# EAGLE design MiniCob (EAGLE 6.1)

## Sheet 1 of 4
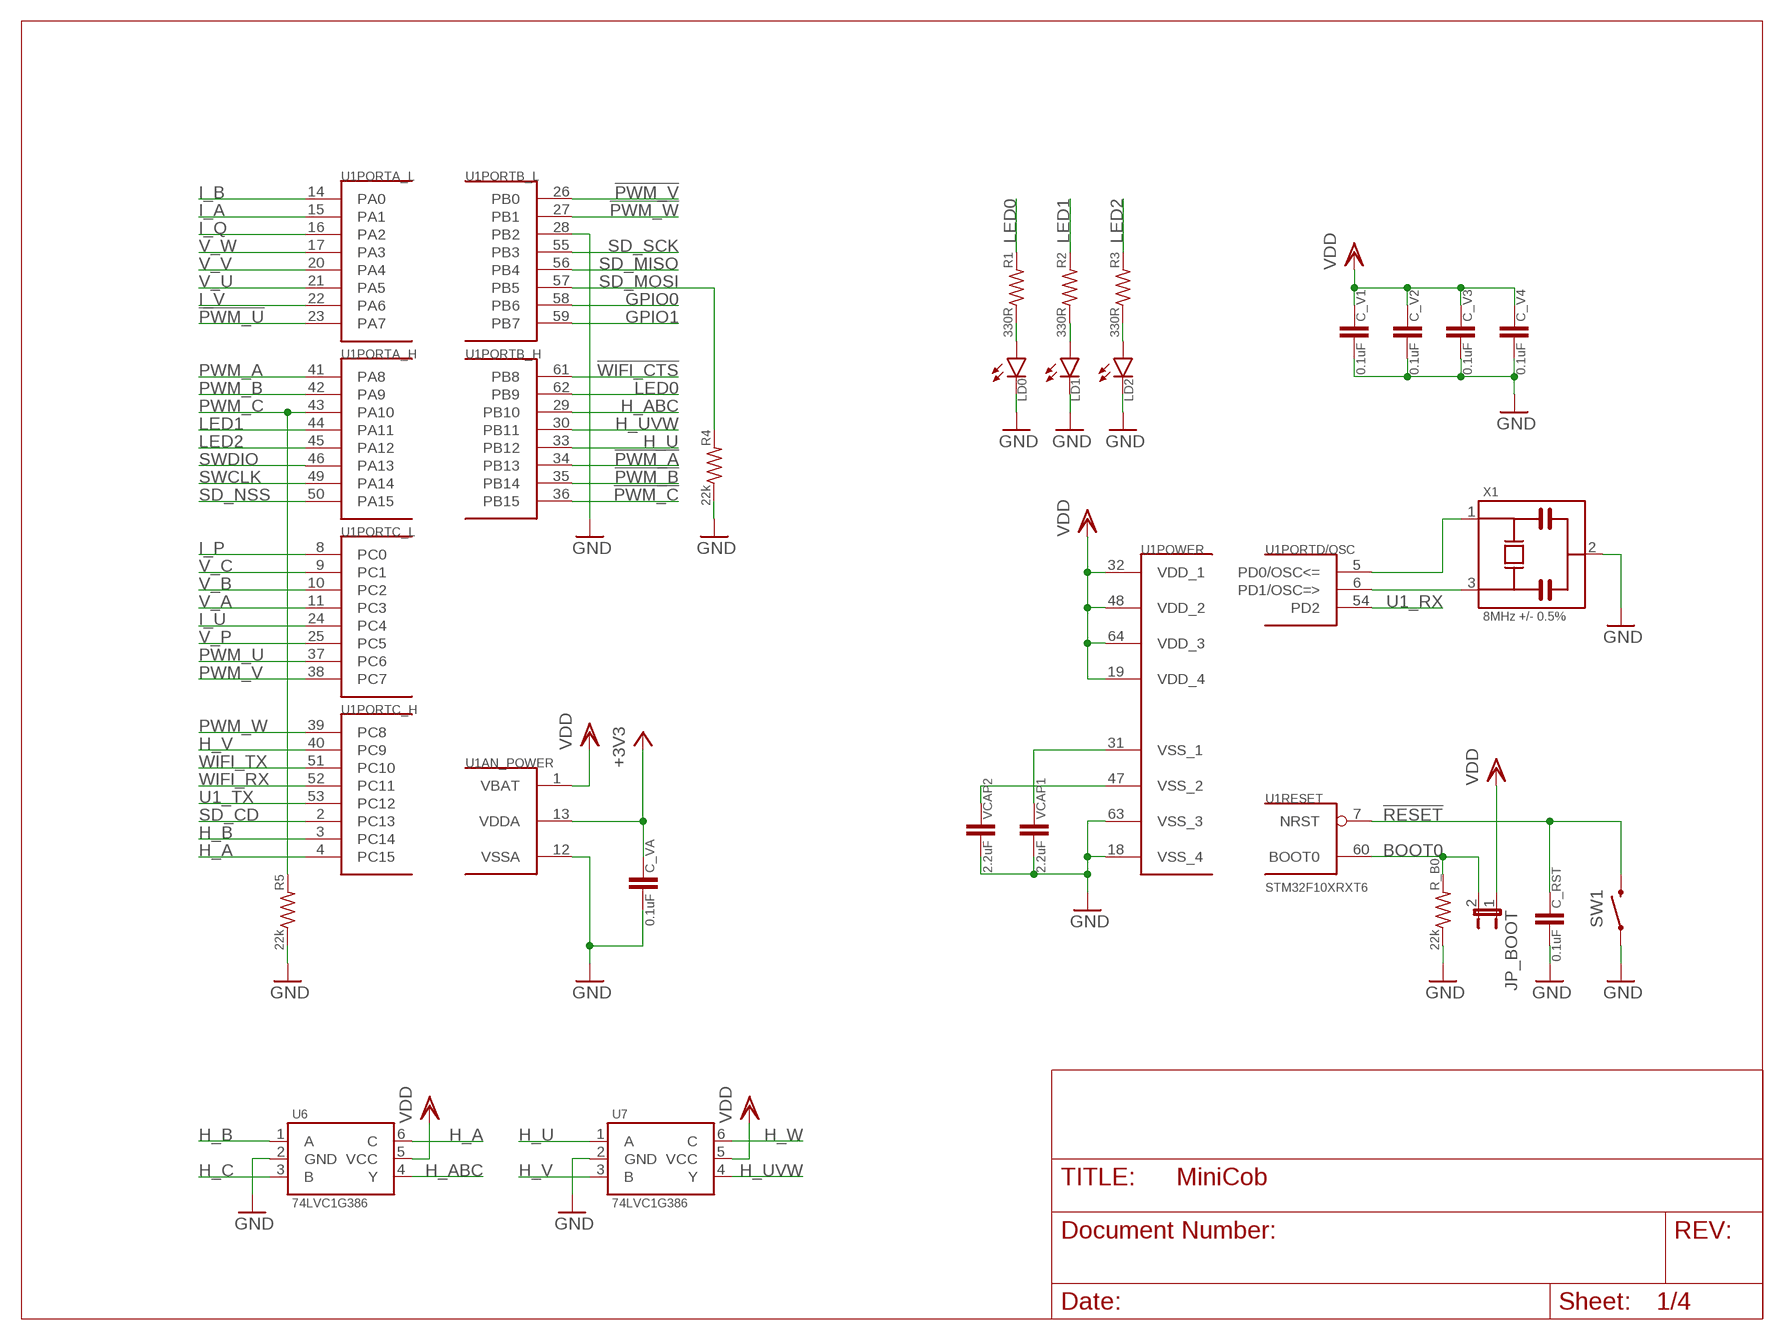
[diagram p0: schematic, sheet 1]

### Parts
C_RST  0.1uF  C0603  [0603]
C_V1  0.1uF  C0603  [0603]
C_V2  0.1uF  C0603  [0603]
C_V3  0.1uF  C0603  [0603]
C_V4  0.1uF  C0603  [0603]
C_VA  0.1uF  C0603  [0603]
JP_BOOT  JUMPER-2PTH  [1X02]
LD0  LED0805  [0805_POL]
LD1  LED0805  [0805_POL]
LD2  LED0805  [0805_POL]
R1  330R  R0603  [0603]
R2  330R  R0603  [0603]
R3  330R  R0603  [0603]
R4  22k  R0603  [0603]
R5  22k  R0603  [0603]
R_B0  22k  R0603  [0603]
SW1  SWITCH_SPST-NO  [B3U-1000P]
U1  STM32F10XRXT6  [TQFP64]
U6  74LVC1G386  [SC-70]
U7  74LVC1G386  [SC-70]
VCAP1  2.2uF  C0603  [0603]
VCAP2  2.2uF  C0603  [0603]
X1  8MHz +/- 0.5%  MURATA_CSTCE  [MURATA_CSTCE]

### Nets
!PWM_A: U1.34(PORTB_H:PB13) ; also sheet 2
!PWM_B: U1.35(PORTB_H:PB14) ; also sheet 2
!PWM_C: U1.36(PORTB_H:PB15) ; also sheet 2
!PWM_U: U1.23(PORTA_L:PA7) ; also sheet 2
!PWM_V: U1.26(PORTB_L:PB0) ; also sheet 2
!PWM_W: U1.27(PORTB_L:PB1) ; also sheet 2
!RESET: C_RST.1 SW1.2 U1.7(RESET:NRST) ; also sheet 2
!WIFI_CTS: U1.61(PORTB_H:PB8) ; also sheet 3
+3V3: C_VA.1 U1.13(AN_POWER:VDDA) ; also sheet 4
BOOT0: JP_BOOT.2 R_B0.2 U1.60(RESET:BOOT0)
GND: C_RST.2 C_V1.2 C_V2.2 C_V3.2 C_V4.2 C_VA.2 LD0.-(C) LD1.-(C) LD2.-(C) R4.1 R5.1 R_B0.1 SW1.1 U1.12(AN_POWER:VSSA) U1.18(POWER:VSS_4) U1.28(PORTB_L:PB2) U1.63(POWER:VSS_3) U6.2(GND) U7.2(GND) VCAP1.2 VCAP2.2 X1.2 ; also sheet 2,3,4
GPIO0: U1.58(PORTB_L:PB6) ; also sheet 2
GPIO1: U1.59(PORTB_L:PB7) ; also sheet 2
H_A: U1.4(PORTC_H:PC15) U6.6(C) ; also sheet 2
H_ABC: U1.29(PORTB_H:PB10) U6.4(Y)
H_B: U1.3(PORTC_H:PC14) U6.1(A) ; also sheet 2
H_C: U6.3(B) ; also sheet 2
H_U: U1.33(PORTB_H:PB12) U7.1(A) ; also sheet 2
H_UVW: U1.30(PORTB_H:PB11) U7.4(Y)
H_V: U1.40(PORTC_H:PC9) U7.3(B) ; also sheet 2
H_W: U7.6(C) ; also sheet 2
I_A: U1.15(PORTA_L:PA1) ; also sheet 2
I_B: U1.14(PORTA_L:PA0) ; also sheet 2
I_P: U1.8(PORTC_L:PC0) ; also sheet 2
I_Q: U1.16(PORTA_L:PA2) ; also sheet 2
I_U: U1.24(PORTC_L:PC4) ; also sheet 2
I_V: U1.22(PORTA_L:PA6) ; also sheet 2
LED0: R1.2 U1.62(PORTB_H:PB9)
LED1: R2.2 U1.44(PORTA_H:PA11)
LED2: R3.2 U1.45(PORTA_H:PA12)
N$1: U1.6(PORTD/OSC:PD1/OSC=>) X1.3
N$2: U1.5(PORTD/OSC:PD0/OSC<=) X1.1
N$3: U1.47(POWER:VSS_2) VCAP2.1
N$4: U1.31(POWER:VSS_1) VCAP1.1
N$5: LD0.+(A) R1.1
N$6: LD1.+(A) R2.1
N$7: LD2.+(A) R3.1
PWM_A: U1.41(PORTA_H:PA8) ; also sheet 2
PWM_B: U1.42(PORTA_H:PA9) ; also sheet 2
PWM_C: R5.2 U1.43(PORTA_H:PA10) ; also sheet 2
PWM_U: U1.37(PORTC_L:PC6) ; also sheet 2
PWM_V: U1.38(PORTC_L:PC7) ; also sheet 2
PWM_W: U1.39(PORTC_H:PC8) ; also sheet 2
SD_CD: U1.2(PORTC_H:PC13) ; also sheet 3
SD_MISO: U1.56(PORTB_L:PB4) ; also sheet 3
SD_MOSI: R4.2 U1.57(PORTB_L:PB5) ; also sheet 3
SD_NSS: U1.50(PORTA_H:PA15) ; also sheet 3
SD_SCK: U1.55(PORTB_L:PB3) ; also sheet 3
SWCLK: U1.49(PORTA_H:PA14) ; also sheet 2
SWDIO: U1.46(PORTA_H:PA13) ; also sheet 2
U1_RX: U1.54(PORTD/OSC:PD2) ; also sheet 2
U1_TX: U1.53(PORTC_H:PC12) ; also sheet 2
V_A: U1.11(PORTC_L:PC3) ; also sheet 2
V_B: U1.10(PORTC_L:PC2) ; also sheet 2
V_C: U1.9(PORTC_L:PC1) ; also sheet 2
V_P: U1.25(PORTC_L:PC5) ; also sheet 2
V_U: U1.21(PORTA_L:PA5) ; also sheet 2
V_V: U1.20(PORTA_L:PA4) ; also sheet 2
V_W: U1.17(PORTA_L:PA3) ; also sheet 2
VDD: C_V1.1 C_V2.1 C_V3.1 C_V4.1 JP_BOOT.1 U1.1(AN_POWER:VBAT) U1.19(POWER:VDD_4) U1.32(POWER:VDD_1) U1.48(POWER:VDD_2) U1.64(POWER:VDD_3) U6.5(VCC) U7.5(VCC) ; also sheet 2,3,4
WIFI_RX: U1.52(PORTC_H:PC11) ; also sheet 3
WIFI_TX: U1.51(PORTC_H:PC10) ; also sheet 3

## Sheet 2 of 4
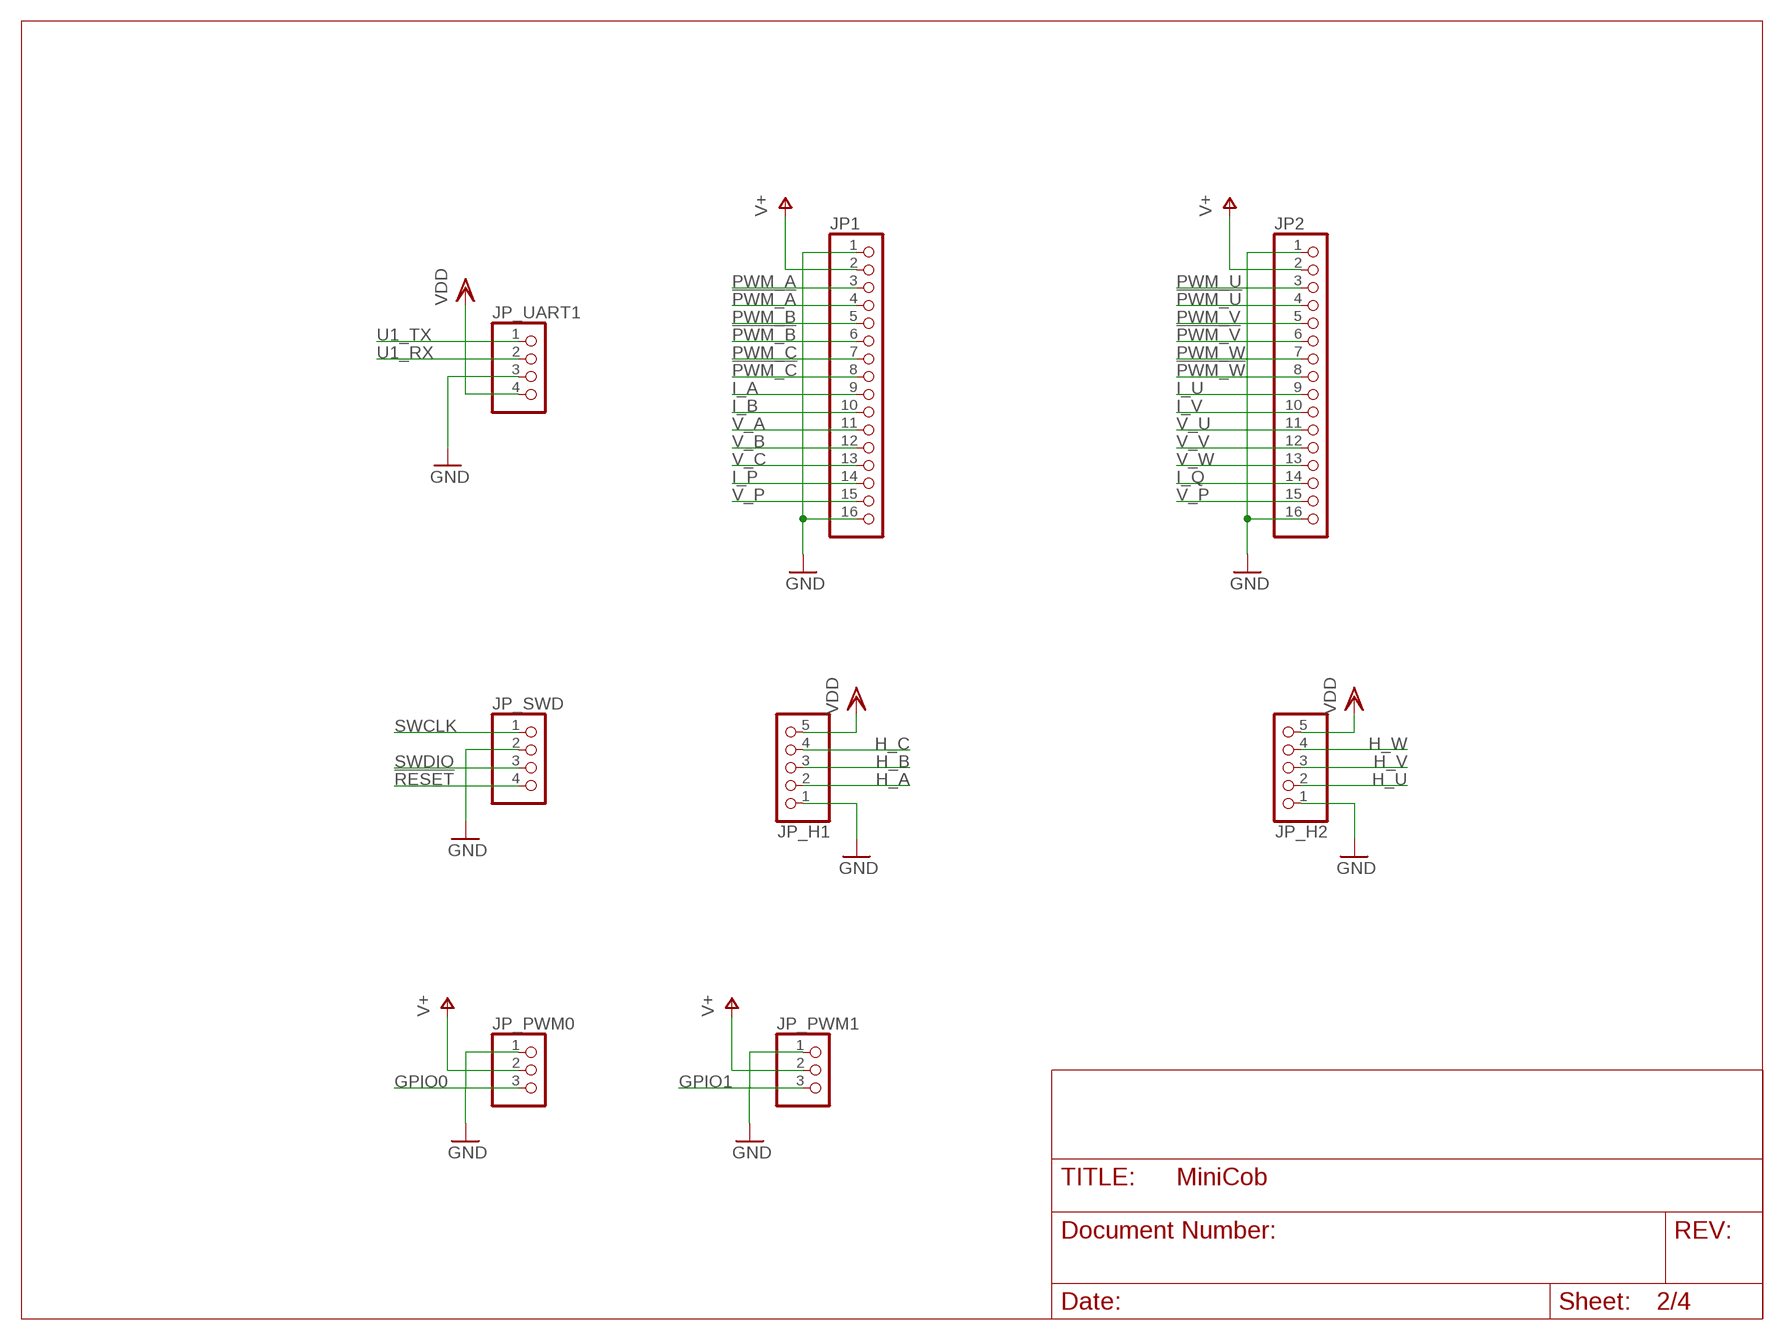
[diagram p1: schematic, sheet 2]

### Parts
JP1  PINHD-1X16_2.54-S  [1X16-S]
JP2  PINHD-1X16_2.54-S  [1X16-S]
JP_H1  PINHD-1X05_2.54-S  [1X05-S]
JP_H2  PINHD-1X05_2.54-S  [1X05-S]
JP_PWM0  PINHD-1X03_2.54-S  [1X03-S]
JP_PWM1  PINHD-1X03_2.54-S  [1X03-S]
JP_SWD  PINHD-1X04_2.54-S  [1X04-S]
JP_UART1  PINHD-1X04_2.54-S  [1X04-S]

### Nets
!PWM_A: JP1.4 ; also sheet 1
!PWM_B: JP1.6 ; also sheet 1
!PWM_C: JP1.8 ; also sheet 1
!PWM_U: JP2.4 ; also sheet 1
!PWM_V: JP2.6 ; also sheet 1
!PWM_W: JP2.8 ; also sheet 1
!RESET: JP_SWD.4 ; also sheet 1
GND: JP1.1 JP1.16 JP2.1 JP2.16 JP_H1.1 JP_H2.1 JP_PWM0.1 JP_PWM1.1 JP_SWD.2 JP_UART1.3 ; also sheet 1,3,4
GPIO0: JP_PWM0.3 ; also sheet 1
GPIO1: JP_PWM1.3 ; also sheet 1
H_A: JP_H1.2 ; also sheet 1
H_B: JP_H1.3 ; also sheet 1
H_C: JP_H1.4 ; also sheet 1
H_U: JP_H2.2 ; also sheet 1
H_V: JP_H2.3 ; also sheet 1
H_W: JP_H2.4 ; also sheet 1
I_A: JP1.9 ; also sheet 1
I_B: JP1.10 ; also sheet 1
I_P: JP1.14 ; also sheet 1
I_Q: JP2.14 ; also sheet 1
I_U: JP2.9 ; also sheet 1
I_V: JP2.10 ; also sheet 1
PWM_A: JP1.3 ; also sheet 1
PWM_B: JP1.5 ; also sheet 1
PWM_C: JP1.7 ; also sheet 1
PWM_U: JP2.3 ; also sheet 1
PWM_V: JP2.5 ; also sheet 1
PWM_W: JP2.7 ; also sheet 1
SWCLK: JP_SWD.1 ; also sheet 1
SWDIO: JP_SWD.3 ; also sheet 1
U1_RX: JP_UART1.2 ; also sheet 1
U1_TX: JP_UART1.1 ; also sheet 1
V+: JP1.2 JP2.2 JP_PWM0.2 JP_PWM1.2 ; also sheet 4
V_A: JP1.11 ; also sheet 1
V_B: JP1.12 ; also sheet 1
V_C: JP1.13 ; also sheet 1
V_P: JP1.15 JP2.15 ; also sheet 1
V_U: JP2.11 ; also sheet 1
V_V: JP2.12 ; also sheet 1
V_W: JP2.13 ; also sheet 1
VDD: JP_H1.5 JP_H2.5 JP_UART1.4 ; also sheet 1,3,4

## Sheet 3 of 4
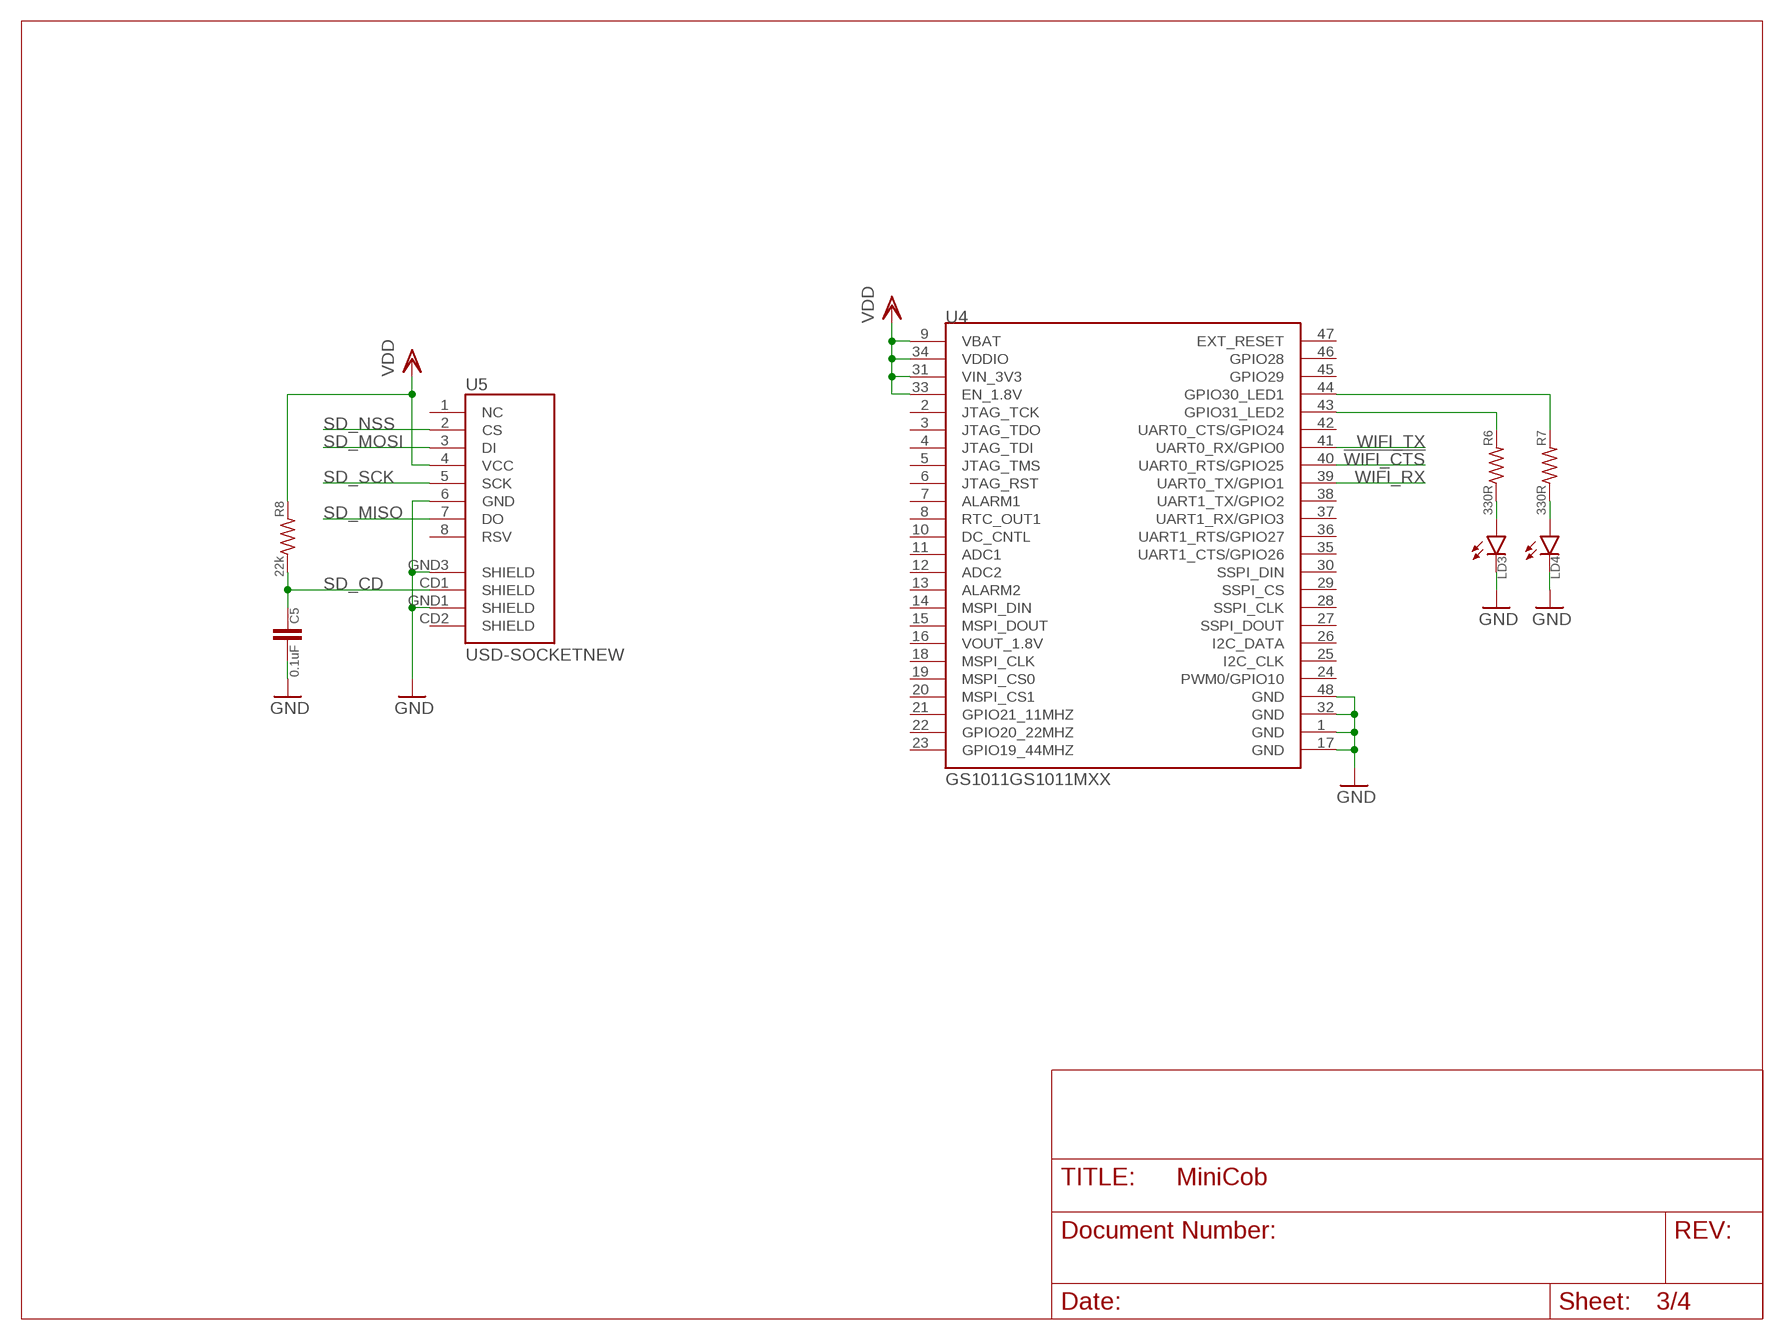
[diagram p2: schematic, sheet 3]

### Parts
C5  0.1uF  C0603  [0603]
LD3  LED0805  [0805_POL]
LD4  LED0805  [0805_POL]
R6  330R  R0603  [0603]
R7  330R  R0603  [0603]
R8  22k  R0603  [0603]
U4  GS1011GS1011MXX  [GS1011MXX]
U5  USD-SOCKETNEW  [MICRO-SD-SOCKET-PP]

### Nets
!WIFI_CTS: U4.40(UART0_RTS/GPIO25) ; also sheet 1
GND: C5.2 LD3.-(C) LD4.-(C) U4.1(GND) U4.17(GND) U4.32(GND) U4.48(GND) U5.6(GND) U5.GND1(SHIELD) U5.GND3(SHIELD) ; also sheet 1,2,4
N$8: R7.2 U4.44(GPIO30_LED1)
N$9: R6.2 U4.43(GPIO31_LED2)
N$10: LD3.+(A) R6.1
N$11: LD4.+(A) R7.1
SD_CD: C5.1 R8.1 U5.CD1(SHIELD) ; also sheet 1
SD_MISO: U5.7(DO) ; also sheet 1
SD_MOSI: U5.3(DI) ; also sheet 1
SD_NSS: U5.2(CS) ; also sheet 1
SD_SCK: U5.5(SCK) ; also sheet 1
VDD: R8.2 U4.9(VBAT) U4.31(VIN_3V3) U4.33(EN_1.8V) U4.34(VDDIO) U5.4(VCC) ; also sheet 1,2,4
WIFI_RX: U4.39(UART0_TX/GPIO1) ; also sheet 1
WIFI_TX: U4.41(UART0_RX/GPIO0) ; also sheet 1
Unconnected: U4.2(JTAG_TCK) U4.3(JTAG_TDO) U4.4(JTAG_TDI) U4.5(JTAG_TMS) U4.6(JTAG_RST) U4.7(ALARM1) U4.8(RTC_OUT1) U4.10(DC_CNTL) U4.11(ADC1) U4.12(ADC2) U4.13(ALARM2) U4.14(MSPI_DIN) U4.15(MSPI_DOUT) U4.16(VOUT_1.8V) U4.18(MSPI_CLK) U4.19(MSPI_CS0) U4.20(MSPI_CS1) U4.21(GPIO21_11MHZ) U4.22(GPIO20_22MHZ) U4.23(GPIO19_44MHZ) U4.24(PWM0/GPIO10) U4.25(I2C_CLK) U4.26(I2C_DATA) U4.27(SSPI_DOUT) U4.28(SSPI_CLK) U4.29(SSPI_CS) U4.30(SSPI_DIN) U4.35(UART1_CTS/GPIO26) U4.36(UART1_RTS/GPIO27) U4.37(UART1_RX/GPIO3) U4.38(UART1_TX/GPIO2) U4.42(UART0_CTS/GPIO24) U4.45(GPIO29) U4.46(GPIO28) U4.47(EXT_RESET) U5.1(NC) U5.8(RSV) U5.CD2(SHIELD)

## Sheet 4 of 4
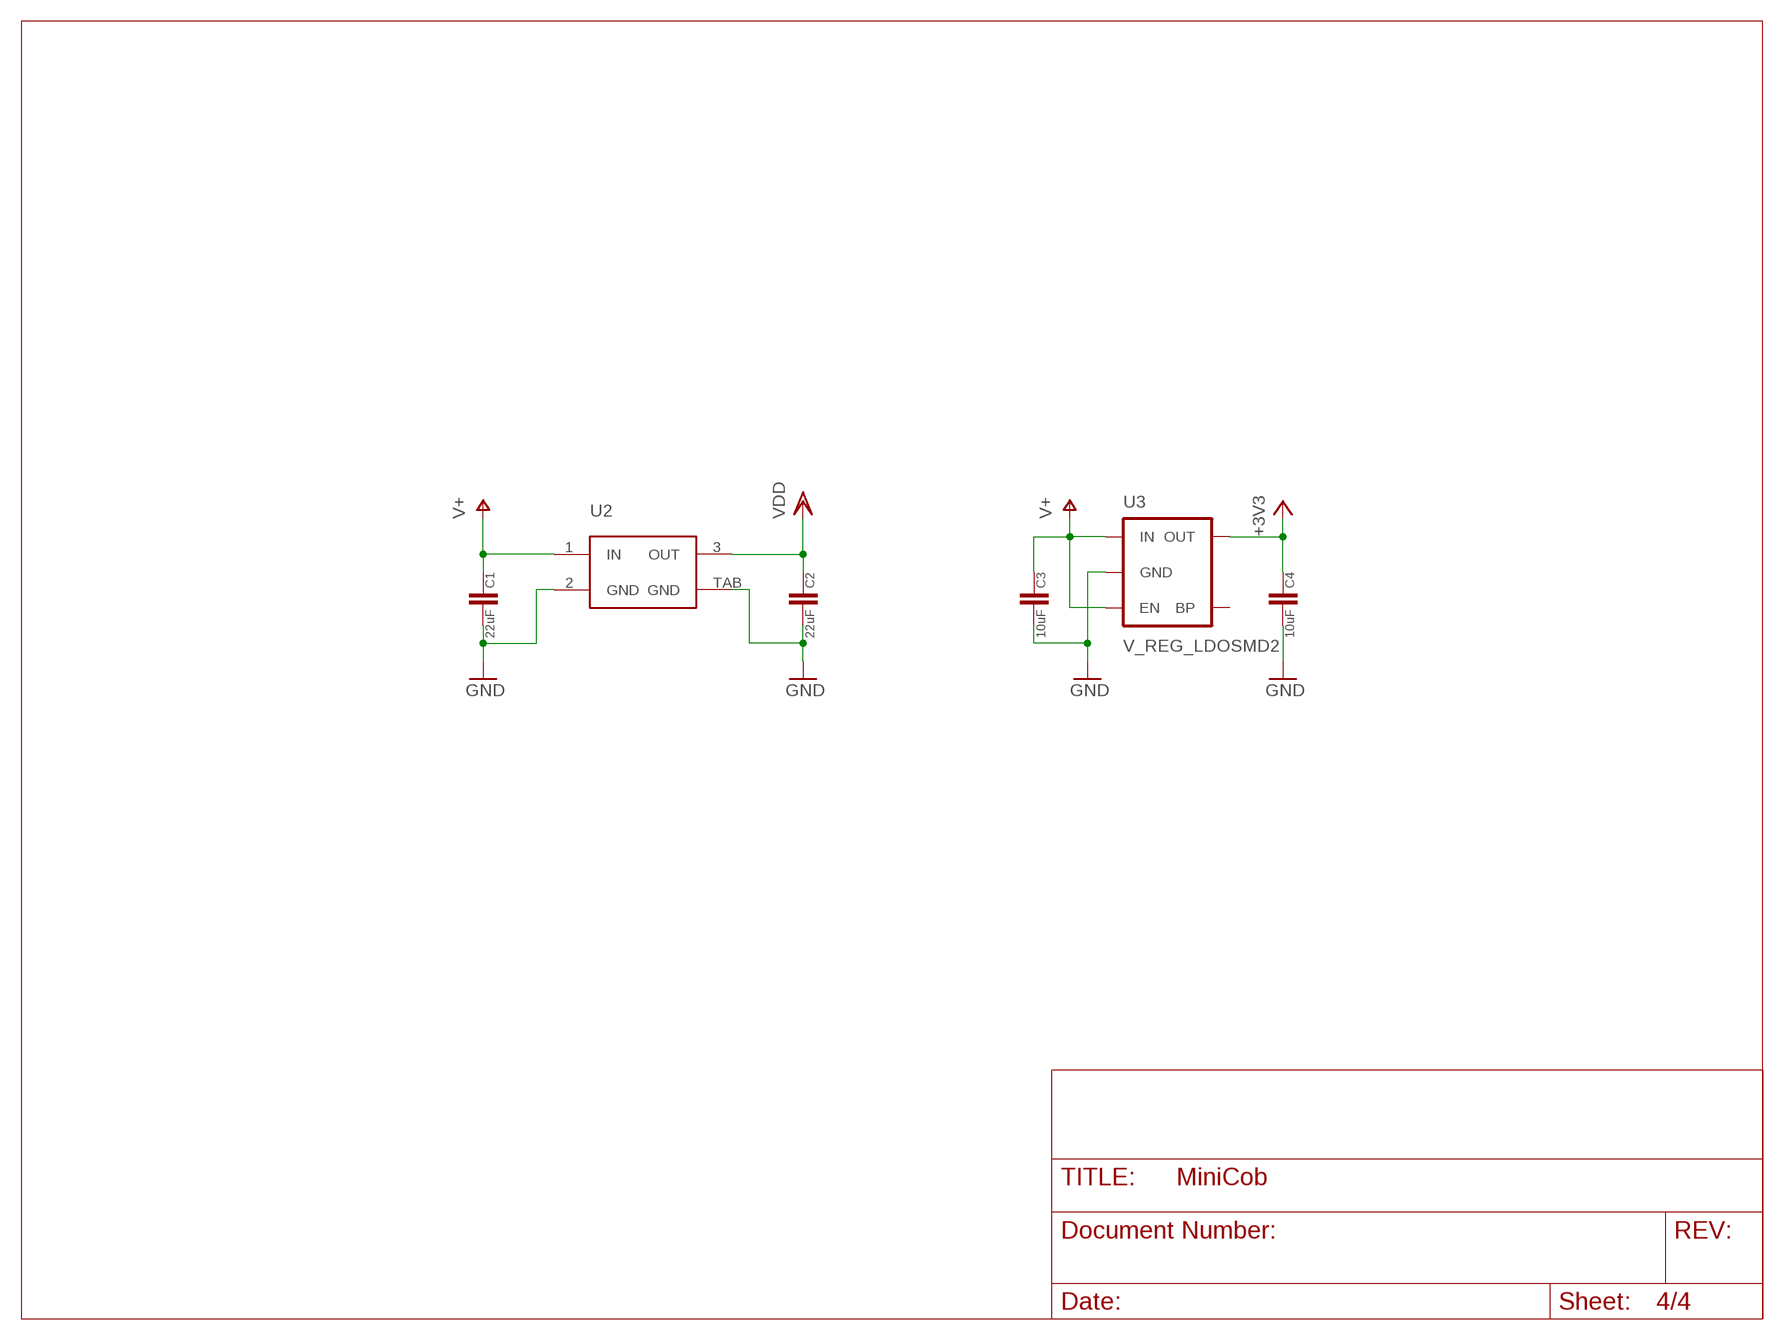
[diagram p3: schematic, sheet 4]

### Parts
C1  22uF  C0805  [0805]
C2  22uF  C0805  [0805]
C3  10uF  C0805  [0805]
C4  10uF  C0805  [0805]
U2  MCP1826S  [SOT223-3L]
U3  V_REG_LDOSMD2  [SC70]

### Nets
+3V3: C4.1 U3.5(OUT) ; also sheet 1
GND: C1.2 C2.2 C3.2 C4.2 U2.2(GND) U2.TAB(GND) U3.2(GND) ; also sheet 1,2,3
V+: C1.1 C3.1 U2.1(IN) U3.1(IN) U3.3(EN) ; also sheet 2
VDD: C2.1 U2.3(OUT) ; also sheet 1,2,3
Unconnected: U3.4(BP)

## Library data of the parts
C1-C5 C_RST C_V1-C_V4 C_VA VCAP1 VCAP2 = dan-rcl:C
JP1 JP2 = pinhead-2:PINHD-1X16: PIN HEADER
JP_BOOT = SparkFun:JUMPER-2: Jumper Basic 0.1" spaced jumper. Use with breakaway headers.
JP_H1 JP_H2 = pinhead-2:PINHD-1X05: PIN HEADER
JP_PWM0 JP_PWM1 = pinhead-2:PINHD-1X03: PIN HEADER
JP_SWD JP_UART1 = pinhead-2:PINHD-1X04: PIN HEADER
LD0 LD1-LD4 = dan-led:LED: LED
R1-R8 R_B0 = dan-rcl:R
SW1 = xow:SWITCH_SPST-NO
U1 = stm32:STM32F10XRXT6: STM32F101/103 64pin LQFP
U2 = dan-vreg:MCP1826S: MCP1826S 1A LDO Features 1000 mA Output Current Capability Input Operating Voltage Range: 2.3V to 6.0V Standard Fixed Output Voltages: 0.8V, 1.2V, 1.8V, 2.5V, 3.0V, 3.3V, 5.0V Low Dropout Voltage: 250 mV Typical at 1000 mA Typical Output Voltage Tolerance: 0.5% Stable with 1.0 µF Ceramic Output Capacitor Fast response to Load Transients Low Supply Current: 120 µA (typ) Short Circuit Current Limiting and Overtemperature Protection TO-263-3 (DDPAK-3), TO-220-3, SOT-223-3 Package Options (MCP1826S).
U3 = SparkFun:V_REG_LDO: Voltage Regulator LDO Standard 150mA LDO voltage regulator in SOT-23 layout. Micrel part MIC5205. BP (by-pass) pin is used to lower output noise with 470pF cap.
U4 = SparkFun:GS1011: GainSpan GS1011M Low-Power Wireless SOC Wi-Fi Module
U5 = SparkFun:USD-SOCKET: microSD Socket Push-push type uSD socket. Schematic element and footprint production proven. Spark Fun Electronics SKU : PRT-00127. tDoc lines correctly indicate media card edge positions when inserting (unlocked, locked, depressed).
U6 U7 = xow:74LVC1G386: 3-input XOR gate in SC-70-6/SOT-363/SC-88
X1 = xow:MURATA_CSTCE

## Board
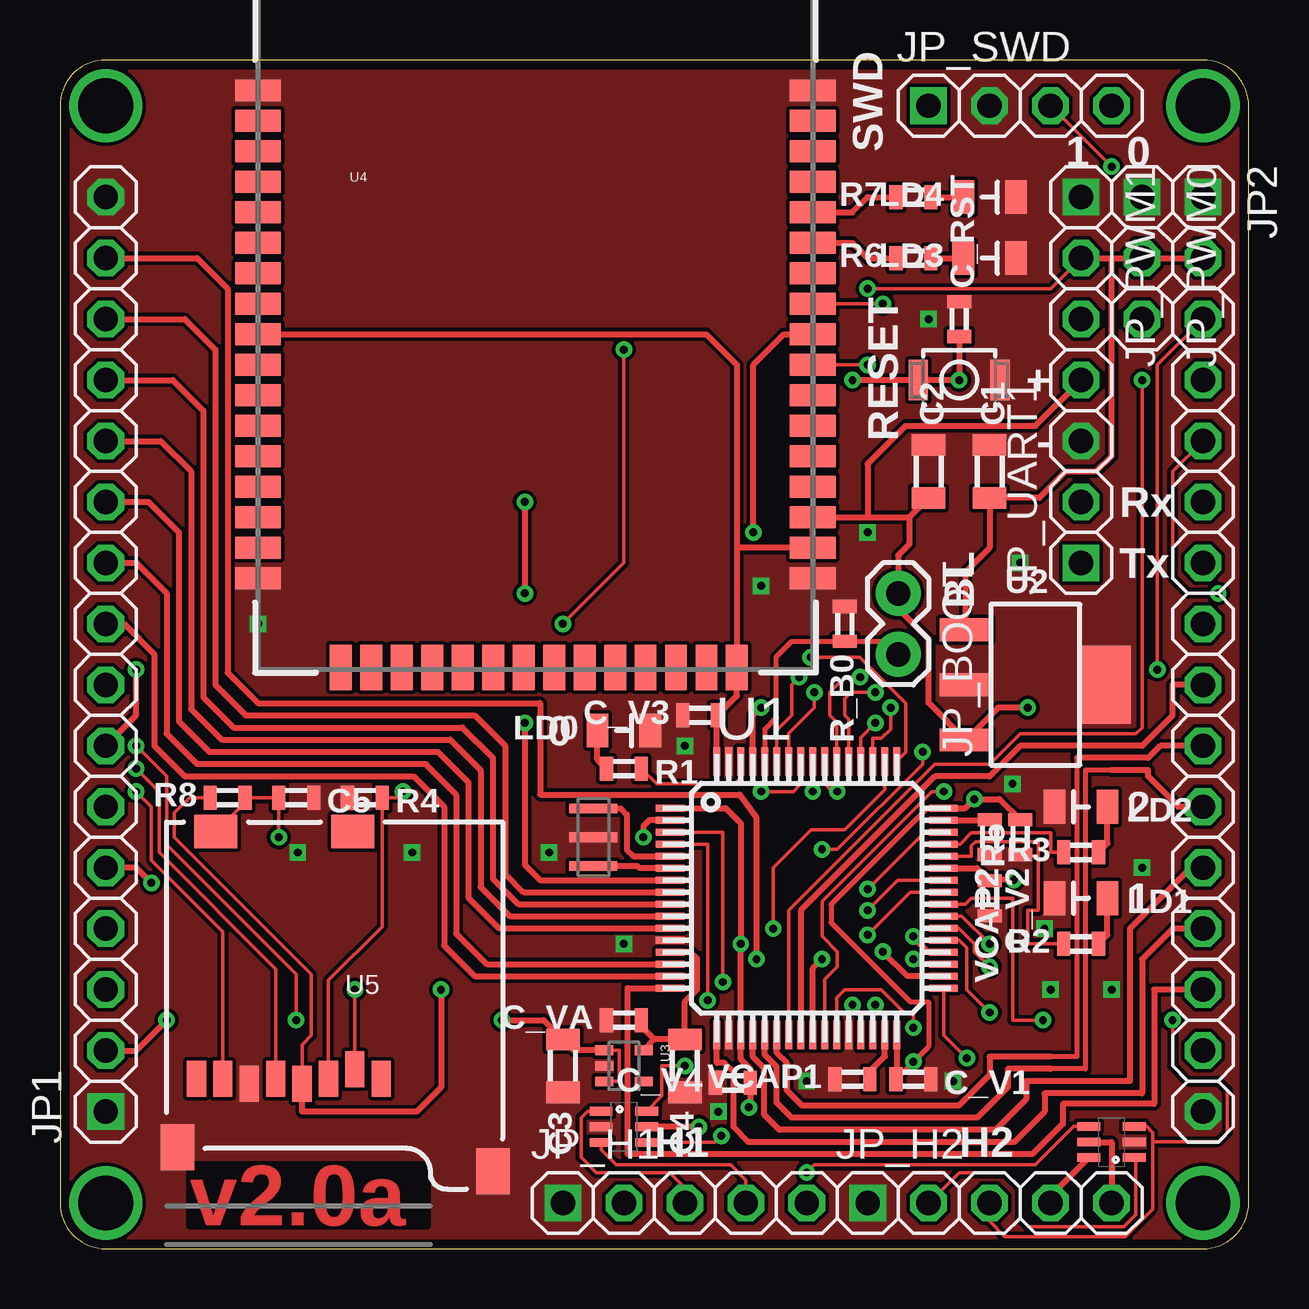
[diagram p4: board, top side]
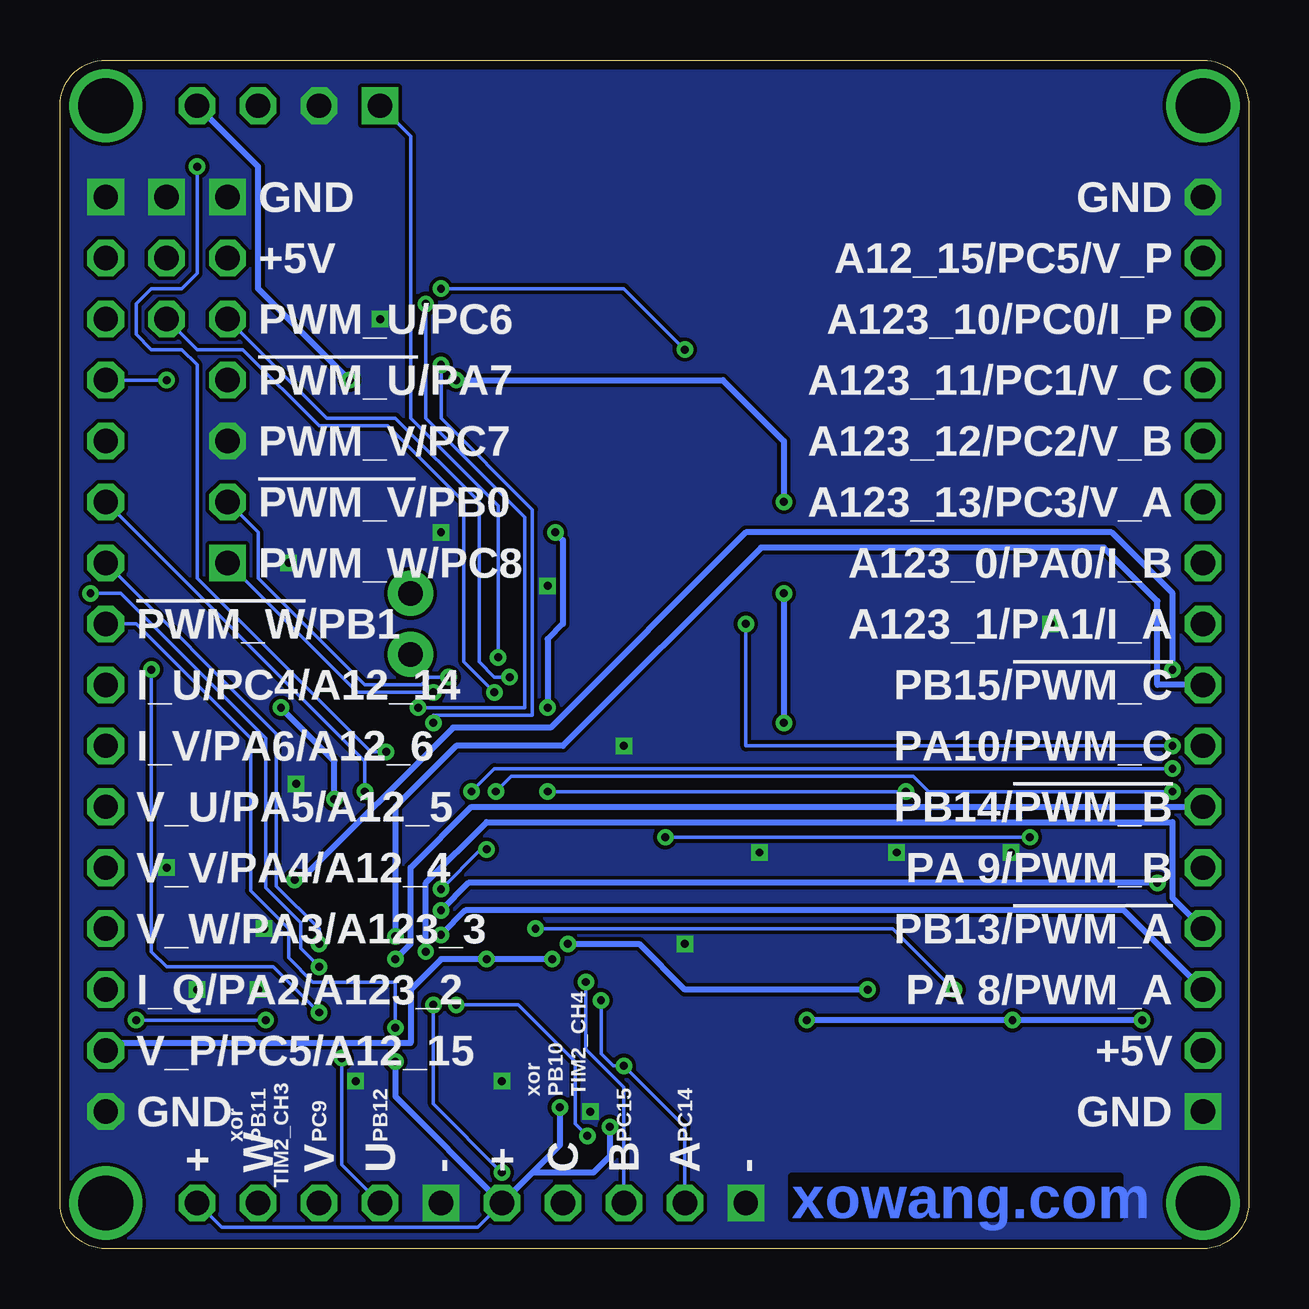
[diagram p5: board, bottom side, seen from below]

Size 49.53 x 49.53 mm. Coordinates in mm from the lower left corner, seen from the top.
Outline: 0,47.62 0,1.91 arc90 1.91,0 47.62,0 arc90 49.53,1.91 49.53,47.62 arc90 47.62,49.53 1.91,49.53 arc90 0,47.62
Copper layers (1*16): Top 0.0356mm / dielectric 1.5011mm / Bottom 0.0356mm
Design rules: minimum track width 6mil, minimum drill 13mil, track to track 6mil, track to pad 6mil, pad to pad 6mil, via to via 6mil, smd to smd 6mil, copper to edge 15mil, drill to drill 6mil, minimum pad ring 7mil, minimum via ring 7mil, stop-mask expansion 4mil, vias tented up to drill 13mil, thermal gap 10mil

### Footprints (pad centres in the part's own frame; a part is rotated, then mirrored left to right if it is on the bottom)
0805 = smd 0.9 x 1.4: 1 -1.1,0; 2 1.1,0
0603 = smd 0.55 x 1: 1 -0.725,0; 2 0.725,0
1X16-S = drill 1.016 square: 1 -19.05,0 | drill 1.016 octagon: 2 -16.51,0; 3 -13.97,0; 4 -11.43,0; 5 -8.89,0; 6 -6.35,0; 7 -3.81,0; 8 -1.27,0; 9 1.27,0; 10 3.81,0; 11 6.35,0; 12 8.89,0; 13 11.43,0; 14 13.97,0; 15 16.51,0; 16 19.05,0
1X02 = drill 1.016 pad 1.88: 1 0,0; 2 2.54,0
1X05-S = drill 1.016 square: 1 -5.08,0 | drill 1.016 octagon: 2 -2.54,0; 3 0,0; 4 2.54,0; 5 5.08,0
1X03-S = drill 1.016 square: 1 -2.54,0 | drill 1.016 octagon: 2 0,0; 3 2.54,0
1X04-S = drill 1.016 square: 1 -3.81,0 | drill 1.016 octagon: 2 -1.27,0; 3 1.27,0; 4 3.81,0
0805_POL = smd 0.9 x 1.4: + 1.1,0; - -1.1,0
B3U-1000P = smd 0.8 x 1.7: 1 1.7,0; 2 -1.7,0
TQFP64 = smd 1.2 x 0.3: 1 -5.7,3.75; 2 -5.7,3.25; 3 -5.7,2.75; 4 -5.7,2.25; 5 -5.7,1.75; 6 -5.7,1.25; 7 -5.7,0.75; 8 -5.7,0.25; 9 -5.7,-0.25; 10 -5.7,-0.75; 11 -5.7,-1.25; 12 -5.7,-1.75; 13 -5.7,-2.25; 14 -5.7,-2.75; 15 -5.7,-3.25; 16 -5.7,-3.75; 33 5.7,-3.75; 34 5.7,-3.25; 35 5.7,-2.75; 36 5.7,-2.25; 37 5.7,-1.75; 38 5.7,-1.25; 39 5.7,-0.75; 40 5.7,-0.25; 41 5.7,0.25; 42 5.7,0.75; 43 5.7,1.25; 44 5.7,1.75; 45 5.7,2.25; 46 5.7,2.75; 47 5.7,3.25; 48 5.7,3.75 | smd 0.3 x 1.2: 17 -3.75,-5.7; 18 -3.25,-5.7; 19 -2.75,-5.7; 20 -2.25,-5.7; 21 -1.75,-5.7; 22 -1.25,-5.7; 23 -0.75,-5.7; 24 -0.25,-5.7; 25 0.25,-5.7; 26 0.75,-5.7; 27 1.25,-5.7; 28 1.75,-5.7; 29 2.25,-5.7; 30 2.75,-5.7; 31 3.25,-5.7; 32 3.75,-5.7; 49 3.75,5.7; 50 3.25,5.7; 51 2.75,5.7; 52 2.25,5.7; 53 1.75,5.7; 54 1.25,5.7; 55 0.75,5.7; 56 0.25,5.7; 57 -0.25,5.7; 58 -0.75,5.7; 59 -1.25,5.7; 60 -1.75,5.7; 61 -2.25,5.7; 62 -2.75,5.7; 63 -3.25,5.7; 64 -3.75,5.7
SOT223-3L = smd 0.95 x 2.15: 1 -2.3,-2.9; 2 0,-2.9; 3 2.3,-2.9 | smd 3.25 x 2.15: TAB 0,2.9
SC70 = smd 0.4 x 0.75: 1 -0.65,-0.825; 2 0,-0.825; 3 0.65,-0.825; 4 0.65,0.825; 5 -0.65,0.825
GS1011MXX = smd 1.905 x 0.914: 1 -11.43,7.62; 2 -11.43,6.35; 3 -11.43,5.08; 4 -11.43,3.81; 5 -11.43,2.54; 6 -11.43,1.27; 7 -11.43,0; 8 -11.43,-1.27; 9 -11.43,-2.54; 10 -11.43,-3.81; 11 -11.43,-5.08; 12 -11.43,-6.35; 13 -11.43,-7.62; 14 -11.43,-8.89; 15 -11.43,-10.16; 16 -11.43,-11.43; 17 -11.43,-12.7; 32 11.684,-12.7; 33 11.684,-11.43; 34 11.684,-10.16; 35 11.684,-8.89; 36 11.684,-7.62; 37 11.684,-6.35; 38 11.684,-5.08; 39 11.684,-3.81; 40 11.684,-2.54; 41 11.684,-1.27; 42 11.684,0; 43 11.684,1.27; 44 11.684,2.54; 45 11.684,3.81; 46 11.684,5.08; 47 11.684,6.35; 48 11.684,7.62 | smd 0.914 x 1.905: 18 -7.988,-16.421; 19 -6.718,-16.421; 20 -5.448,-16.421; 21 -4.178,-16.421; 22 -2.908,-16.421; 23 -1.638,-16.421; 24 -0.368,-16.421; 25 0.902,-16.421; 26 2.172,-16.421; 27 3.442,-16.421; 28 4.712,-16.421; 29 5.982,-16.421; 30 7.252,-16.421; 31 8.522,-16.421
MICRO-SD-SOCKET-PP = smd 0.8 x 1.5: 1 -8.94,10.7; 2 -7.84,10.3; 3 -6.74,10.7; 4 -5.64,10.9; 5 -4.54,10.7; 6 -3.44,10.9; 7 -2.34,10.7; 8 -1.24,10.7 | smd 1.8 x 1.4: CD1 -2.05,0.4; CD2 -7.75,0.4 | smd 1.4 x 1.9: GND1 -13.6,14.55; GND3 -0.45,13.55
SC-70 = smd 0.36 x 0.95: 1 -0.65,-0.95; 2 0,-0.95; 3 0.65,-0.95; 4 0.65,0.95; 5 0,0.95; 6 -0.65,0.95
MURATA_CSTCE = smd 0.4 x 2: 1 -1.2,0; 2 0,0; 3 1.2,0

### Placement (x,y rotation side)
C1  38.73,32.38 90 top
C2  36.2,32.38 90 top
C3  20.96,7.62 270 top
C4  26.04,7.62 270 top
C5  9.84,18.8 0 top
C_RST  37.46,38.73 90 top
C_V1  35.56,7.06 0 top
C_V2  40,17.15 270 top
C_V3  26.67,22.23 180 top
C_V4  28.04,6.91 180 top
C_VA  23.5,9.53 180 top
JP1  1.91,24.77 90 top
JP2  47.62,24.77 270 top
JP_BOOT  34.92,27.31 270 top
JP_H1  26.04,1.91 0 top
JP_H2  38.73,1.91 0 top
JP_PWM0  45.09,41.27 270 top
JP_PWM1  42.54,41.27 270 top
JP_SWD  40,47.62 0 top
JP_UART1  42.54,32.38 90 top
LD0  23.5,21.59 180 top
LD1  42.54,14.61 0 top
LD2  42.54,18.42 0 top
LD3  38.73,41.27 180 top
LD4  38.73,43.81 180 top
R1  23.5,20 0 top
R2  42.54,12.7 180 top
R3  42.54,16.51 180 top
R4  12.7,18.8 0 top
R5  38.73,14.61 90 top
R6  35.56,41.27 180 top
R7  35.56,43.81 180 top
R8  6.98,18.8 180 top
R_B0  32.7,26.04 270 top
SW1  37.46,36.2 0 top
U1  31.12,14.61 0 top
U2  40.64,23.5 270 top
U3  23.5,7.62 270 top
U4  19.69,40.64 0 top
U5  4.45,17.78 180 top
U6  23.5,5.08 270 top
U7  43.81,4.45 90 top
VCAP1  33.02,7.06 180 top
VCAP2  38.73,17.15 270 top
X1  22.23,17.15 270 top

### Tracks (layer width: path | path; a pad name or v marks a point on that pad's centre or on a via)
!PWM_A  (via drill 0.33)
  Top 0.254: U1.34 35.32,11.36 v34.29,12.38
  Bottom 0.254: JP1.4 3.17,14.61 3.17,17.78 31.75,17.78 34.29,15.24 v34.29,12.38
!PWM_B  (via drill 0.33)
  Top 0.254: U1.35 35.77,11.86 v35.56,12.06
  Bottom 0.254: v35.56,12.06 34.92,12.7 34.92,15.88 32.38,18.42 JP1.6
!PWM_C  (via drill 0.33)
  Top 0.254: v35.56,13.02 35.56,12.96 36.17,12.36 U1.36
  Bottom 0.254: v35.56,13.02 35.56,18.42 33.02,20.96 28.58,20.96 20.32,29.21 6.03,29.21 3.81,26.99 3.81,23.5 JP1.8
!PWM_U  (via drill 0.33)
  Top 0.152: U1.23 30.37,14.11 36.45,20.19 38.73,20.19 40,21.46 44.83,21.46 45.09,21.72 v45.09,36.2
  Bottom 0.152: JP2.4 v45.09,36.2
!PWM_V  (via drill 0.33)
  Top 0.152: U1.26 31.87,11.23 32.38,11.75 32.38,12.38 31.75,13.02 31.75,14.48 36.32,19.05 v36.83,19.05
  Bottom 0.152: v36.83,19.05 36.83,20.32 JP2.6
!PWM_W  (via drill 0.33)
  Top 0.152: v35.56,9.21 35.56,9.84 35.18,9.84 34.23,10.79 32.7,10.79 32.37,10.46 U1.27
  Bottom 0.152: JP2.8 46.35,26.04 41.59,21.27 41.59,14.92 40,13.33 40,12.13 38.99,11.11 35.56,11.11 v35.56,9.21
!RESET  (via drill 0.33)
  Top 0.254: C_RST.1 v37.46,36.2 | v37.46,36.2 SW1.2 35.56,36.2 | v37.46,36.2 v33.02,36.2 | v19.37,31.12 v19.37,27.31 | v19.37,21.91 19.37,15.99 20,15.36 U1.7
  Bottom 0.254: v37.46,36.2 41.27,40 41.27,45.09 JP_SWD.4 | v33.02,36.2 21.91,36.2 19.37,33.66 v19.37,31.12 | v19.37,27.31 v19.37,21.91
!WIFI_CTS  (via drill 0.33)
  Top 0.254: v28.89,29.85 28.89,36.83 30.16,38.1 U4.40 | U1.61 28.87,22.2 v29.21,22.54
  Bottom 0.254: v28.89,29.85 28.58,29.53 28.58,26.04 29.21,25.4 v29.21,22.54
+3V3
  Top 0.254: U1.13 26.29,12.36 26.54,12.1 26.54,10.79 26.04,10.29 C4.1 24.77,8.72 | 24.77,8.72 U3.5 | 24.77,8.72 24.22,9.27 C_VA.1
BOOT0
  Top 0.203: JP_BOOT.2 34.38,25.31 R_B0.2 30.48,25.31 29.85,24.68 29.85,22.14 29.37,21.66 U1.60
GND  (via drill 0.33)
  other vias: 8.26,26.04 31.12,6.98 20.38,16.51 41.27,10.79 23.5,12.7 27.43,5.71 37.21,6.98 26.04,20.96 41.02,13.33 39.69,19.37 43.81,10.79 45.09,15.88 33.66,29.85 29.21,27.62 14.67,16.51 9.91,16.51 36.2,38.73 40,28.58
  pour Top (rank 6, no thermals): 0,47.62 0,1.91 arc90 1.91,0 47.62,0 arc90 49.53,1.91 49.53,47.62 arc90 47.62,49.53 1.91,49.53 arc90
  pour Bottom (rank 6, no thermals): 47.62,0 1.91,0 arc-90 0,1.91 0,47.62 arc-90 1.91,49.53 47.62,49.53 arc-90 49.53,47.62 49.53,1.91 arc-90
GPIO0  (via drill 0.33)
  Top 0.152: U1.58 30.37,21.48 31.43,22.54 v31.43,23.18
  Bottom 0.152: v31.43,23.18 32.7,24.45 32.7,31.12 35.88,34.29 38.73,34.29 41.91,37.46 43.81,37.46 JP_PWM0.3
GPIO1  (via drill 0.33)
  Top 0.152: U1.59 29.87,21.61 30.48,22.23 30.48,23.5 v30.8,23.81
  Bottom 0.152: v30.8,23.81 31.43,23.81 32.07,24.45 32.07,31.12 35.56,34.61 38.42,34.61 JP_PWM1.3
H_A  (via drill 0.33)
  Top 0.152: v26.04,7.62 25.08,7.62 25.08,6.37 U6.6 | v26.99,10.35 26.99,16.86 U1.4
  Bottom 0.152: JP_H1.2 23.5,5.08 v26.04,7.62 26.48,7.62 26.99,8.13 v26.99,10.35
H_ABC  (via drill 0.33)
  Top 0.152: U6.4 27.29,4.43 v27.56,4.7 | v33.02,10.16 33.36,9.81 U1.29
  Bottom 0.152: v27.56,4.7 28.07,5.21 28.07,7.8 30.43,10.16 v33.02,10.16
H_B  (via drill 0.33)
  Top 0.152: JP_H1.3 26.04,2.54 25.4,3.17 22.35,3.17 21.72,3.81 21.72,5.46 21.99,5.73 U6.1 | U1.3 27.62,17.36 v27.62,11.11
  Bottom 0.152: v27.62,11.11 27.62,8.32 26.04,6.73 JP_H1.3
H_C
  Top 0.152: JP_H1.4 28.58,2.86 27.94,3.49 23.18,3.49 22.55,4.13 U6.3
H_U  (via drill 0.33)
  Top 0.152: JP_H2.2 37.46,3.17 39.37,3.17 40,2.54 40,1.27 40.36,0.91 44.32,0.91 44.83,1.42 44.83,3.79 U7.1 | U1.33 36.81,8.9 v37.78,7.94
  Bottom 0.152: JP_H2.2 37.78,3.49 v37.78,7.94
H_UVW  (via drill 0.33)
  Top 0.152: 42.54,5.09 U7.4 42.24,5.09 40.64,3.49 31.43,3.49 v31.12,3.17 | v33.97,10.16 33.86,10.05 U1.30
  Bottom 0.152: v31.12,3.17 33.97,6.03 v33.97,10.16
H_V  (via drill 0.33)
  Top 0.152: JP_H2.3 38.73,1.14 39.37,0.51 44.39,0.51 45.53,1.65 45.53,4.46 | 45.53,4.46 48.26,4.46 48.64,4.84 48.64,6.6 48.26,6.98 46.99,6.98 46.35,7.62 v46.35,9.53 | U1.40 37.72,14.36 37.97,14.61 39.69,14.61 39.69,9.53 v40.96,9.53 | 45.53,4.46 45.53,4.84 45.28,5.09 U7.3
  Bottom 0.152: v40.96,9.53 v46.35,9.53
H_W
  Top 0.254: JP_H2.4 41.27,2.21 U7.6
I_A
  Top 0.254: JP1.9 2.67,26.04 3.94,24.77 3.94,20.96 5.21,19.69 14.73,19.69 16,18.42 16,12.62 17.27,11.36 U1.15
I_B
  Top 0.254: JP1.10 3.17,28.58 4.45,27.31 4.45,21.46 5.71,20.19 15.24,20.19 16.51,18.92 16.51,13.12 17.78,11.86 U1.14
I_P
  Top 0.254: JP1.14 5.21,38.73 6.48,37.46 6.48,23.5 7.75,22.23 17.27,22.23 18.54,20.96 18.54,15.62 19.31,14.86 U1.8
I_Q
  Top 0.254: JP2.14 45.59,10.79 45.59,6.03 41.78,6.03 41.78,5.21 40.51,3.94 23.65,3.94 23.65,10.86 U1.16
I_U
  Top 0.254: JP2.9 46.35,23.5 46.35,22.23 45.09,20.96 40,20.96 38.73,19.69 36.45,19.69 30.87,14.1 U1.24
I_V
  Top 0.203: 42.37,20.45 42.37,8 41.27,8
  Top 0.254: 41.27,8 38.73,8 38.73,7.24 37.46,5.97 30.91,5.97 30.27,6.6 30.27,7.75 29.87,8.15 U1.22 | JP2.10 45.85,20.96 45.34,20.45 42.37,20.45
LED0
  Top 0.152: R1.2 24.86,19.37 28.11,19.37 28.37,19.62 U1.62
LED1
  Top 0.152: R2.2 40.32,12.7 40.32,14.1 40.77,14.1 40.77,16.97 38.15,16.97 37.97,16.79 37.97,16.36 U1.44
LED2
  Top 0.152: R3.2 41.27,16.51 41.27,17.32 37.97,17.32 37.5,16.86 U1.45
N$1
  Top 0.254: U1.6 24.15,15.86 24.06,15.95 X1.3
N$2
  Top 0.254: X1.1 23.37,18.35 23.62,18.09 23.62,16.61 23.88,16.36 U1.5
N$3
  Top 0.254: U1.47 38.72,17.86 VCAP2.1
N$4
  Top 0.254: VCAP1.1 33.74,7.39 34.36,8.01 U1.31
N$5
  Top 0.254: R1.1 22.4,20.38 LD0.+
N$6
  Top 0.254: R2.1 43.64,13.07 LD1.+
N$7
  Top 0.254: R3.1 43.64,16.89 LD2.+
N$8
  Top 0.254: U4.44 33.02,43.18 33.66,43.81 R7.2
N$9
  Top 0.254: U4.43 33.02,41.91 33.66,41.27 R6.2
N$10
  Top 0.254: R6.1 LD3.+
N$11
  Top 0.254: R7.1 LD4.+
N$13  (via drill 2.29 pad 1.27)
  other vias: 1.91,47.62
N$14  (via drill 2.29 pad 1.27)
  other vias: 47.62,47.62
N$15  (via drill 2.29 pad 1.27)
  other vias: 47.62,1.91
N$16  (via drill 2.29 pad 1.27)
  other vias: 1.91,1.91
PWM_A  (via drill 0.33)
  Top 0.152: v33.66,13.08 35.43,14.86 U1.41
  Bottom 0.254: JP1.3 5.21,14.1 32.64,14.1 v33.66,13.08
PWM_B  (via drill 0.33)
  Top 0.152: v33.66,14.1 34.91,15.36 U1.42
  Top 0.254: v3.81,15.24 3.17,15.88 JP1.5
  Bottom 0.254: v3.81,15.24 32.51,15.24 v33.66,14.1
PWM_C  (via drill 0.33)
  Top 0.254: v39.75,15.37 38.77,15.37 R5.2 38.21,15.86 U1.43 | JP1.7 3.17,22.23 v3.17,24.13
  Bottom 0.254: v3.17,24.13 3.17,27.31 5.71,29.85 20.96,29.85 29.08,21.72 33.15,21.72 39.5,15.37 v39.75,15.37
PWM_U  (via drill 0.33)
  Top 0.152: U1.37 37.48,12.86 37.78,12.55 37.78,10.79 v38.73,9.84 | v45.72,24.13 45.72,36.83 JP2.3
  Bottom 0.152: v38.73,9.84 40.64,11.75 45.09,11.75 45.72,12.38 v45.72,24.13
PWM_V  (via drill 0.33)
  Top 0.152: U1.38 37.45,13.36 38.1,12.7 38.1,12.38 v38.73,11.75 | v48.26,27.31 46.99,27.31 46.35,27.94 46.35,32.38 JP2.5
  Bottom 0.152: v48.26,27.31 46.99,27.31 40.96,21.27 40.96,15.05 39.5,13.59 39.5,12.51 v38.73,11.75
PWM_W  (via drill 0.33)
  Top 0.152: U1.39 37.58,13.86 v38.73,12.7
  Bottom 0.152: v38.73,12.7 38.73,13.33 40.51,15.11 40.51,21.46 JP2.7
SD_CD  (via drill 0.33)
  Top 0.152: v9.12,17.15 C5.1 R8.1 7.71,18.6 U5.CD1
  Top 0.254: U1.2 24.56,17.86 24.31,17.6 v24.31,17.15
  Bottom 0.152: v24.31,17.15 v9.12,17.15
SD_MISO  (via drill 0.33)
  Top 0.152: U1.56 v31.37,19.05 | v3.17,19.05 3.81,18.42 3.81,16.19 6.79,13.22 U5.7
  Bottom 0.152: v31.37,19.05 30.73,19.69 13.97,19.69 13.33,19.05 v3.17,19.05
SD_MOSI  (via drill 0.33)
  Top 0.152: U5.3 11.19,11.19 13.42,13.42 R4.2 14.03,18.8 v14.29,19.05 | U1.57 30.87,19.37 30.55,19.05 v29.21,19.05
  Bottom 0.152: v29.21,19.05 v14.29,19.05
SD_NSS  (via drill 0.33)
  Top 0.152: U1.50 34.36,19.12 32.7,17.46 31.31,17.46 29.72,15.88 v29.72,13.33 | U5.2 v12.29,10.79
  Bottom 0.152: v12.29,10.79 14.82,13.33 v29.72,13.33
SD_SCK  (via drill 0.33)
  Top 0.152: U1.55 31.87,19.37 32.18,19.05 v32.38,19.05 | v3.17,20 4.13,19.05 4.13,16.51 8.98,11.65 U5.5
  Bottom 0.152: v32.38,19.05 31.43,20 v3.17,20
SWCLK  (via drill 0.33)
  Top 0.152: v31.27,24.64 33.32,24.64 35.24,22.72 35.24,20.68 U1.49
  Bottom 0.152: v31.27,24.64 31.27,30.96 34.92,34.61 34.92,46.35 JP_SWD.1
SWDIO  (via drill 0.33)
  Top 0.152: U1.46 36.02,17.36 v33.66,14.99 | v31.75,16.64 32.38,16.64 35.94,20.19 v35.94,20.7 | v43.81,45.09 JP_SWD.3
  Bottom 0.152: v33.66,14.99 32,16.64 v31.75,16.64 | v35.94,20.7 36.58,20.7 43.81,27.94 43.81,36.83 44.45,37.46 45.72,37.46 46.35,38.1 46.35,39.37 45.72,40 44.45,40 43.81,40.64 v43.81,45.09
U1_RX  (via drill 0.33)
  Top 0.152: U1.54 32.37,21.93 32.07,22.23 32.07,23.18 32.7,23.81 v33.34,23.81
  Bottom 0.152: v33.34,23.81 34.15,23.81 34.47,23.5 36.83,23.5 41.27,27.94 41.27,29.85 JP_UART1.2
U1_TX  (via drill 0.33)
  Top 0.152: U1.53 32.86,22.06 32.7,22.23 32.7,22.92 32.96,23.18 v33.97,23.18
  Bottom 0.152: v33.97,23.18 37.15,23.18 JP_UART1.1
V+  (via drill 0.33)
  Top 0.152: U3.1 23.29,8.27 23.29,6.97 U3.3 | v9.84,9.53 9.84,11.43 4.45,16.83 4.45,19.69 v3.17,20.96 | v20.96,26.04 23.5,28.58 v23.5,37.46 | v33.66,40 41.27,40 JP_PWM1.2
  Top 0.254: U3.1 21.41,8.27 C3.1 20.15,9.53 v18.42,9.53 | U2.1 37.74,28.21 38.73,29.21 C1.1 40.81,31.29 41.91,32.38 43.18,32.38 43.81,33.02 43.81,41.27 | JP1.2 3.17,8.26 v4.45,9.53 | JP_PWM1.2 43.81,41.27 | 43.81,41.27 JP_PWM0.2 JP2.2
  Bottom 0.152: v3.17,20.96 20.96,20.96 v20.96,26.04 | v23.5,37.46 26.04,40 v33.66,40
  Bottom 0.254: v4.45,9.53 v9.84,9.53 v18.42,9.53
V_A
  Top 0.254: JP1.11 3.68,31.12 4.95,29.85 4.95,21.97 6.22,20.7 15.75,20.7 17.02,19.43 17.02,14.62 18.29,13.36 U1.11
V_B
  Top 0.254: JP1.12 4.19,33.66 5.46,32.38 5.46,22.48 6.73,21.21 16.26,21.21 17.53,19.94 17.53,15.06 18.73,13.86 U1.10
V_C
  Top 0.254: JP1.13 4.7,36.2 5.97,34.92 5.97,22.99 7.24,21.72 16.76,21.72 18.03,20.45 18.03,15.42 19.1,14.36 U1.9
V_P  (via drill 0.33)
  Top 0.254: JP1.15 5.71,41.27 6.98,40 6.98,24 8.26,22.73 20,22.73 20,18.92 28.32,18.92 29.02,17.97 v29.02,12.06 | U1.25 31.37,11.68 v31.75,12.06
  Bottom 0.254: v29.02,12.06 v31.75,12.06 33.66,12.06 34.92,10.79 34.92,8.57 47.31,8.57 JP2.15
V_U
  Top 0.203: 43.81,19.94 42.72,19.94 42.72,7.49 41.27,7.49
  Top 0.254: JP2.11 46.61,18.42 45.34,19.69 45.34,19.94 43.81,19.94 | 41.27,7.49 39.5,7.49 39.5,6.73 38.23,5.46 30.48,5.46 29.85,6.1 29.85,7.59 29.37,8.08 U1.21
V_V
  Top 0.254: JP2.12 47.12,15.88 44.58,13.33 44.58,6.98 40.26,6.98 40.26,6.22 38.99,4.95 29.97,4.95 29.34,5.59 29.34,7.52 28.87,7.99 U1.20
V_W
  Top 0.254: JP2.13 46.35,13.33 45.09,12.06 45.09,6.48 41.02,6.48 41.02,5.71 39.75,4.45 28.7,4.45 28.07,5.08 28.07,7.37 27.69,7.75 27.37,7.75 U1.17
VDD  (via drill 0.33)
  Top 0.152: R8.2 5.4,18.8 4.76,18.16 4.76,17.15 10.48,11.43 10.48,8.89 10.08,8.5 U5.4
  Top 0.203: U1.48 36.13,18.36 32.13,14.35 32.13,13.59 35.43,10.29 36.2,10.29 36.2,8.42 35.57,7.8 | v35.56,7.8 35.57,7.8 | 35.57,7.8 C_V1.1
  Top 0.254: U4.9 26.94,38.1 28.21,36.83 28.21,29.21 | 28.21,29.21 U4.31 28.21,23.04 C_V3.1 27.37,22.2 U1.64 | 28.21,29.21 U4.33 U4.34 33.66,30.48 | 33.66,30.48 35.39,30.48 | 35.39,30.48 C2.1 | 35.39,30.48 35.39,29.36 34.92,28.89 JP_BOOT.1 34.92,26.67 36.2,25.4 36.2,22.74 U2.3 39.09,22.54 v40.32,22.54 | 33.66,30.48 33.66,32.7 35.24,34.29 40.64,34.29 JP_UART1.4 | v28.7,5.89 28.77,6.03 C_V4.1 28.77,7.49 28.37,7.89 U1.19 v28.37,12.7 28.37,17.72 27.73,18.36 U1.1 | U7.5 43.81,4.45 JP_H2.5 | v26.62,5.08 U6.5 | U1.32 34.86,6.98 C_V1.1 | U1.48 37.72,18.36 v38.1,18.73 39.14,18.73 C_V2.1 | v15.88,10.79 15.88,6.73 14.86,5.71 10.08,5.71 U5.4
  Bottom 0.152: JP_H2.5 42.8,0.89 32.13,0.89 JP_H1.5
  Bottom 0.254: v28.7,5.89 28.7,4.32 29.85,3.17 | 29.85,3.17 JP_H1.5 35.56,6.35 v35.56,7.8 | v26.62,5.08 26.62,3.86 27.31,3.17 29.85,3.17 | v38.1,18.73 38.1,20.32 v40.32,22.54 | v28.37,12.7 25.4,12.7 23.5,10.79 v15.88,10.79
WIFI_RX  (via drill 0.33)
  Top 0.152: U1.52 33.36,21.3 v33.97,21.91 | v33.66,36.83 U4.39
  Bottom 0.152: v33.97,21.91 33.97,22.23 29.85,22.23 29.85,30.8 33.66,34.61 v33.66,36.83
WIFI_TX  (via drill 0.33)
  Top 0.152: U1.51 33.86,21.27 34.23,21.27 34.61,21.65 v34.61,22.54 | v34.29,39.37 U4.41
  Bottom 0.152: v34.61,22.54 30.16,22.54 30.16,30.48 34.29,34.61 v34.29,39.37

### Text on the board
Top: v2.0a
Bottom: xowang.com
tPlace: SWD | 1 | 0 | + | - | RESET | Rx | Tx | BL | 0 | 2 | 1 | H1 | H2
bPlace: GND | GND | A12_15/PC5/V_P | +5V | A123_10/PC0/I_P | PWM_U/PC6 | A123_11/PC1/V_C | !PWM_U!/PA7 | A123_12/PC2/V_B | PWM_V/PC7 | A123_13/PC3/V_A | !PWM_V!/PB0 | A123_0/PA0/I_B | PWM_W/PC8 | A123_1/PA1/I_A | !PWM_W!/PB1 | PB15/!PWM_C | I_U/PC4/A12_14 | PA10/PWM_C | I_V/PA6/A12_6 | PB14/!PWM_B | V_U/PA5/A12_5 | PA 9/PWM_B | V_V/PA4/A12_4 | PB13/!PWM_A | V_W/PA3/A123_3 | PA 8/PWM_A | I_Q/PA2/A123_2 | +5V | V_P/PC5/A12_15 | GND | TIM2_CH4 | PB10 | xor | PC14 | PC15 | PB12 | PC9 | PB11 | xor | GND | - | A | B | C | + | - | U | V | W | + | TIM2_CH3